# EAGLE design oled (EAGLE 7.3.0)
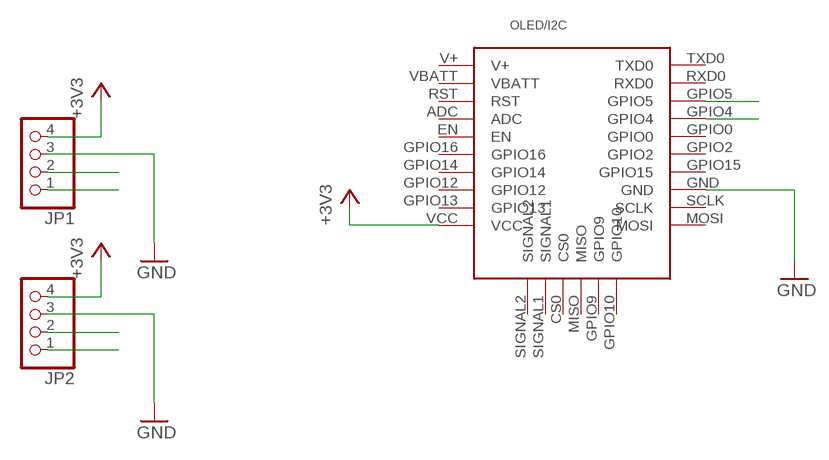
[diagram p0: schematic, sheet 1]

## Parts
JP1  PINHD-1X4  [1X04]
JP2  PINHD-1X4  [1X04]
OLED/I2C  ESP-BOARD  [ESP-BOARD]

## Nets
+3V3: JP1.4 JP2.4 OLED/I2C.VCC
GND: JP1.3 JP2.3 OLED/I2C.GND
SCL: JP1.2 JP2.2 OLED/I2C.GPIO5
SDA: JP1.1 JP2.1 OLED/I2C.GPIO4
Unconnected: OLED/I2C.ADC OLED/I2C.CS0 OLED/I2C.EN OLED/I2C.GPIO0 OLED/I2C.GPIO2 OLED/I2C.GPIO9 OLED/I2C.GPIO10 OLED/I2C.GPIO12 OLED/I2C.GPIO13 OLED/I2C.GPIO14 OLED/I2C.GPIO15 OLED/I2C.GPIO16 OLED/I2C.MISO OLED/I2C.MOSI OLED/I2C.RST OLED/I2C.RXD0 OLED/I2C.SCLK OLED/I2C.SIGNAL1 OLED/I2C.SIGNAL2 OLED/I2C.TXD0

## Power pins joined to a net without a drawn wire
V+: OLED/I2C.V+
VBATT: OLED/I2C.VBATT

## Library data of the parts
JP1 JP2 = pinhead:PINHD-1X4: PIN HEADER
OLED/I2C = ESPstack:ESP-BOARD: STANDARIZED ESP-STACK BOARD

## Board
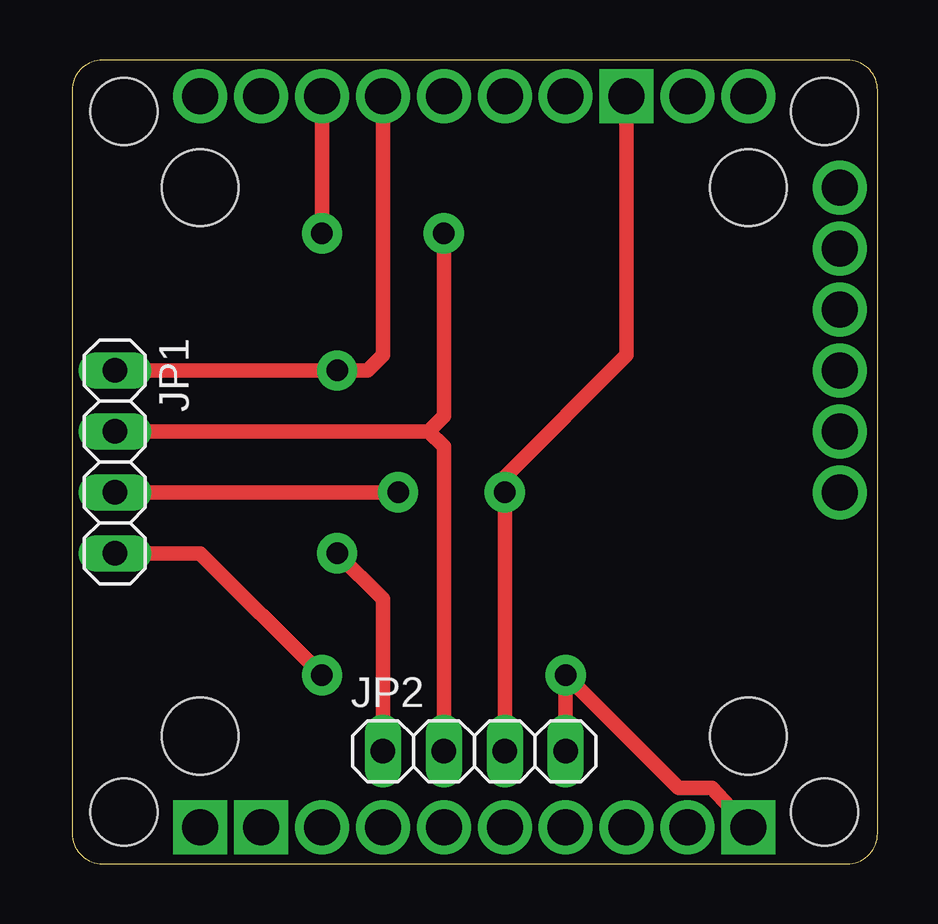
[diagram p1: board, top side]
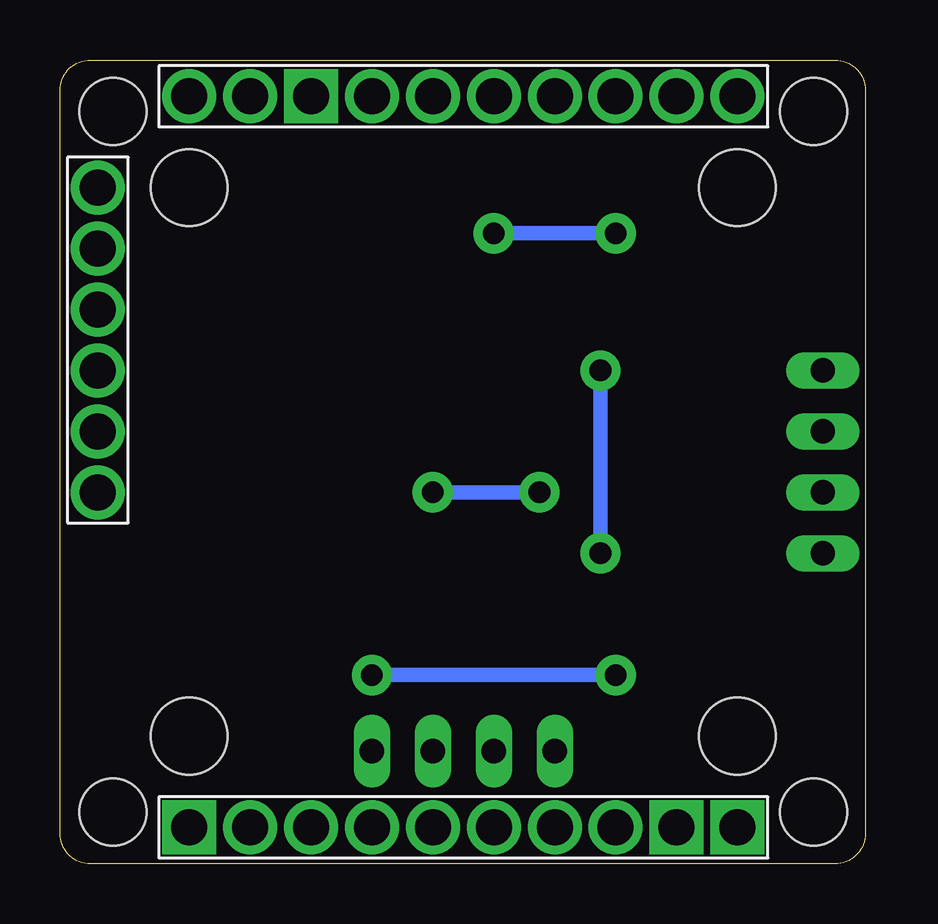
[diagram p2: board, bottom side, seen from below]

Size 33.58 x 33.52 mm. Coordinates in mm from the lower left corner, seen from the top.
Outline: 1.27,0 32.31,0 arc90 33.58,1.27 33.58,32.25 arc90 32.31,33.52 1.27,33.52 arc90 0,32.25 0,1.27 arc90 1.27,0
Copper layers (1*16): Top 0.0356mm / dielectric 1.5011mm / Bottom 0.0356mm
Design rules "LaenPCBOrder": minimum track width 6mil, minimum drill 13mil, track to track 6mil, track to pad 6mil, pad to pad 6mil, via to via 6mil, smd to smd 6mil, copper to edge 15mil, drill to drill 6mil, minimum pad ring 7mil, minimum via ring 7mil, stop-mask expansion 3mil, vias tented up to drill 0mil, thermal gap 10mil
Holes 3.2 mm at 28.19,5.33 5.33,5.33 28.19,28.19 5.33,28.19

### Footprints (pad centres in the part's own frame; a part is rotated, then mirrored left to right if it is on the bottom)
1X04 = drill 1.016 long: 1 -3.81,0; 2 -1.27,0; 3 1.27,0; 4 3.81,0
ESP-BOARD = drill 1.5 pad 2.184: ADC -10.16,-16.51; CS0 8.89,2.54; EN -7.62,-16.51; GPIO0 -7.62,13.97; GPIO2 -5.08,13.97; GPIO4 -10.16,13.97; GPIO5 -12.7,13.97; GPIO9 8.89,7.62; GPIO10 8.89,10.16; GPIO12 0,-16.51; GPIO13 2.54,-16.51; GPIO14 -2.54,-16.51; GPIO15 -2.54,13.97; GPIO16 -5.08,-16.51; MISO 8.89,5.08; MOSI 5.08,13.97; RST -12.7,-16.51; RXD0 -15.24,13.97; SCLK 2.54,13.97; SIGNAL1 8.89,0; SIGNAL2 8.89,-2.54; TXD0 -17.78,13.97 | drill 1.5 pad 2.184 square: GND 0,13.97; V+ -17.78,-16.51; VBATT -15.24,-16.51; VCC 5.08,-16.51 | hole 2.8: 8.255,13.335; -20.955,13.335; 8.255,-15.875; -20.955,-15.875

### Placement (x,y rotation side)
JP1  1.78,16.76 270 top
JP2  16.76,4.7 0 top
OLED/I2C  23.11,18.03 0 top

### Tracks (layer width: path | path; a pad name or v marks a point on that pad's centre or on a via)
+3V3  (via drill 0.9 pad 1.68)
  Top 0.61: JP1.4 5.33,12.95 v10.41,7.87 | JP2.4 v20.57,7.87 25.27,3.17 26.67,3.17 OLED/I2C.VCC
  Bottom 0.61: v10.41,7.87 v20.57,7.87
GND  (via drill 0.9 pad 1.68)
  Top 0.61: JP2.3 v18.03,15.49 18.03,16.13 23.11,21.21 OLED/I2C.GND | JP1.3 v13.59,15.49
  Bottom 0.61: v13.59,15.49 v18.03,15.49
SCL  (via drill 0.9 pad 1.68)
  Top 0.61: JP1.2 14.86,18.03 | 14.86,18.03 15.49,17.4 JP2.2 | OLED/I2C.GPIO5 v10.41,26.29 | v15.49,26.29 15.49,18.67 14.86,18.03
  Bottom 0.61: v10.41,26.29 v15.49,26.29
SDA  (via drill 0.9 pad 1.68)
  Top 0.61: OLED/I2C.GPIO4 12.95,21.21 12.32,20.57 v11.05,20.57 JP1.1 | JP2.1 12.95,11.05 v11.05,12.95
  Bottom 0.61: v11.05,12.95 v11.05,20.57